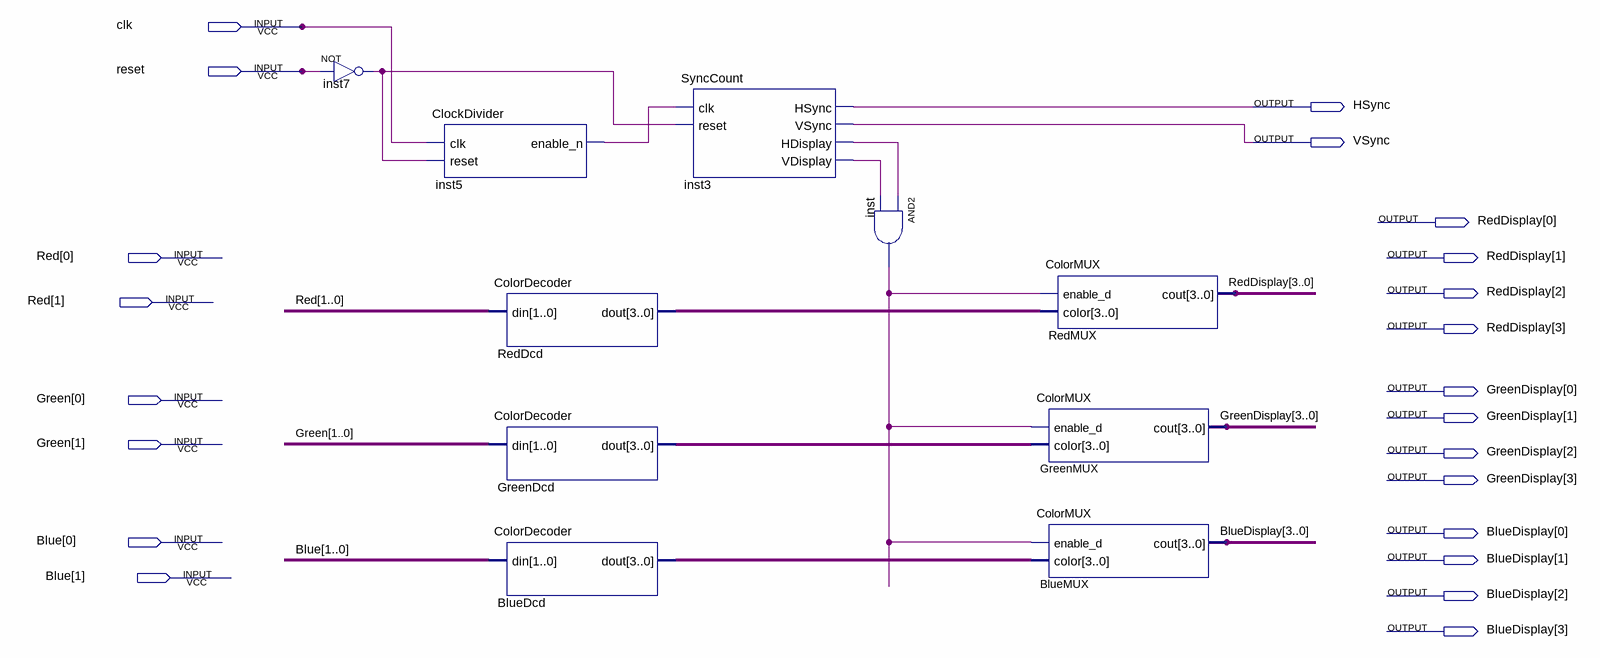
[diagram p0: schematic sheet]
// Quartus schematic VGADriver.bdf as structural Verilog: 10 symbols, 22 pins
module VGADriver (
  input  clk,
  input  reset,
  input  [1:0] Red,
  input  [1:0] Green,
  input  [1:0] Blue,
  output HSync,
  output VSync,
  output [3:0] RedDisplay,
  output [3:0] GreenDisplay,
  output [3:0] BlueDisplay
);

  wire inst3_hdisplay, inst3_vdisplay, inst5_enable_n, inst7_out, inst_out;
  wire [3:0] BlueDcd_dout, GreenDcd_dout, RedDcd_dout;

  not inst7 (inst7_out, reset);
  ClockDivider inst5 (.clk(clk), .reset(inst7_out), .enable_n(inst5_enable_n));
  ColorDecoder RedDcd (.din(Red), .dout(RedDcd_dout));
  ColorDecoder GreenDcd (.din(Green), .dout(GreenDcd_dout));
  ColorDecoder BlueDcd (.din(Blue), .dout(BlueDcd_dout));
  SyncCount inst3 (
    .clk(inst5_enable_n), .reset(inst7_out), .HSync(HSync), .VSync(VSync), .HDisplay(inst3_hdisplay),
    .VDisplay(inst3_vdisplay));
  and inst (inst_out, inst3_hdisplay, inst3_vdisplay);
  ColorMUX RedMUX (.enable_d(inst_out), .color(RedDcd_dout), .cout(RedDisplay));
  ColorMUX GreenMUX (.enable_d(inst_out), .color(GreenDcd_dout), .cout(GreenDisplay));
  ColorMUX BlueMUX (.enable_d(inst_out), .color(BlueDcd_dout), .cout(BlueDisplay));
endmodule
